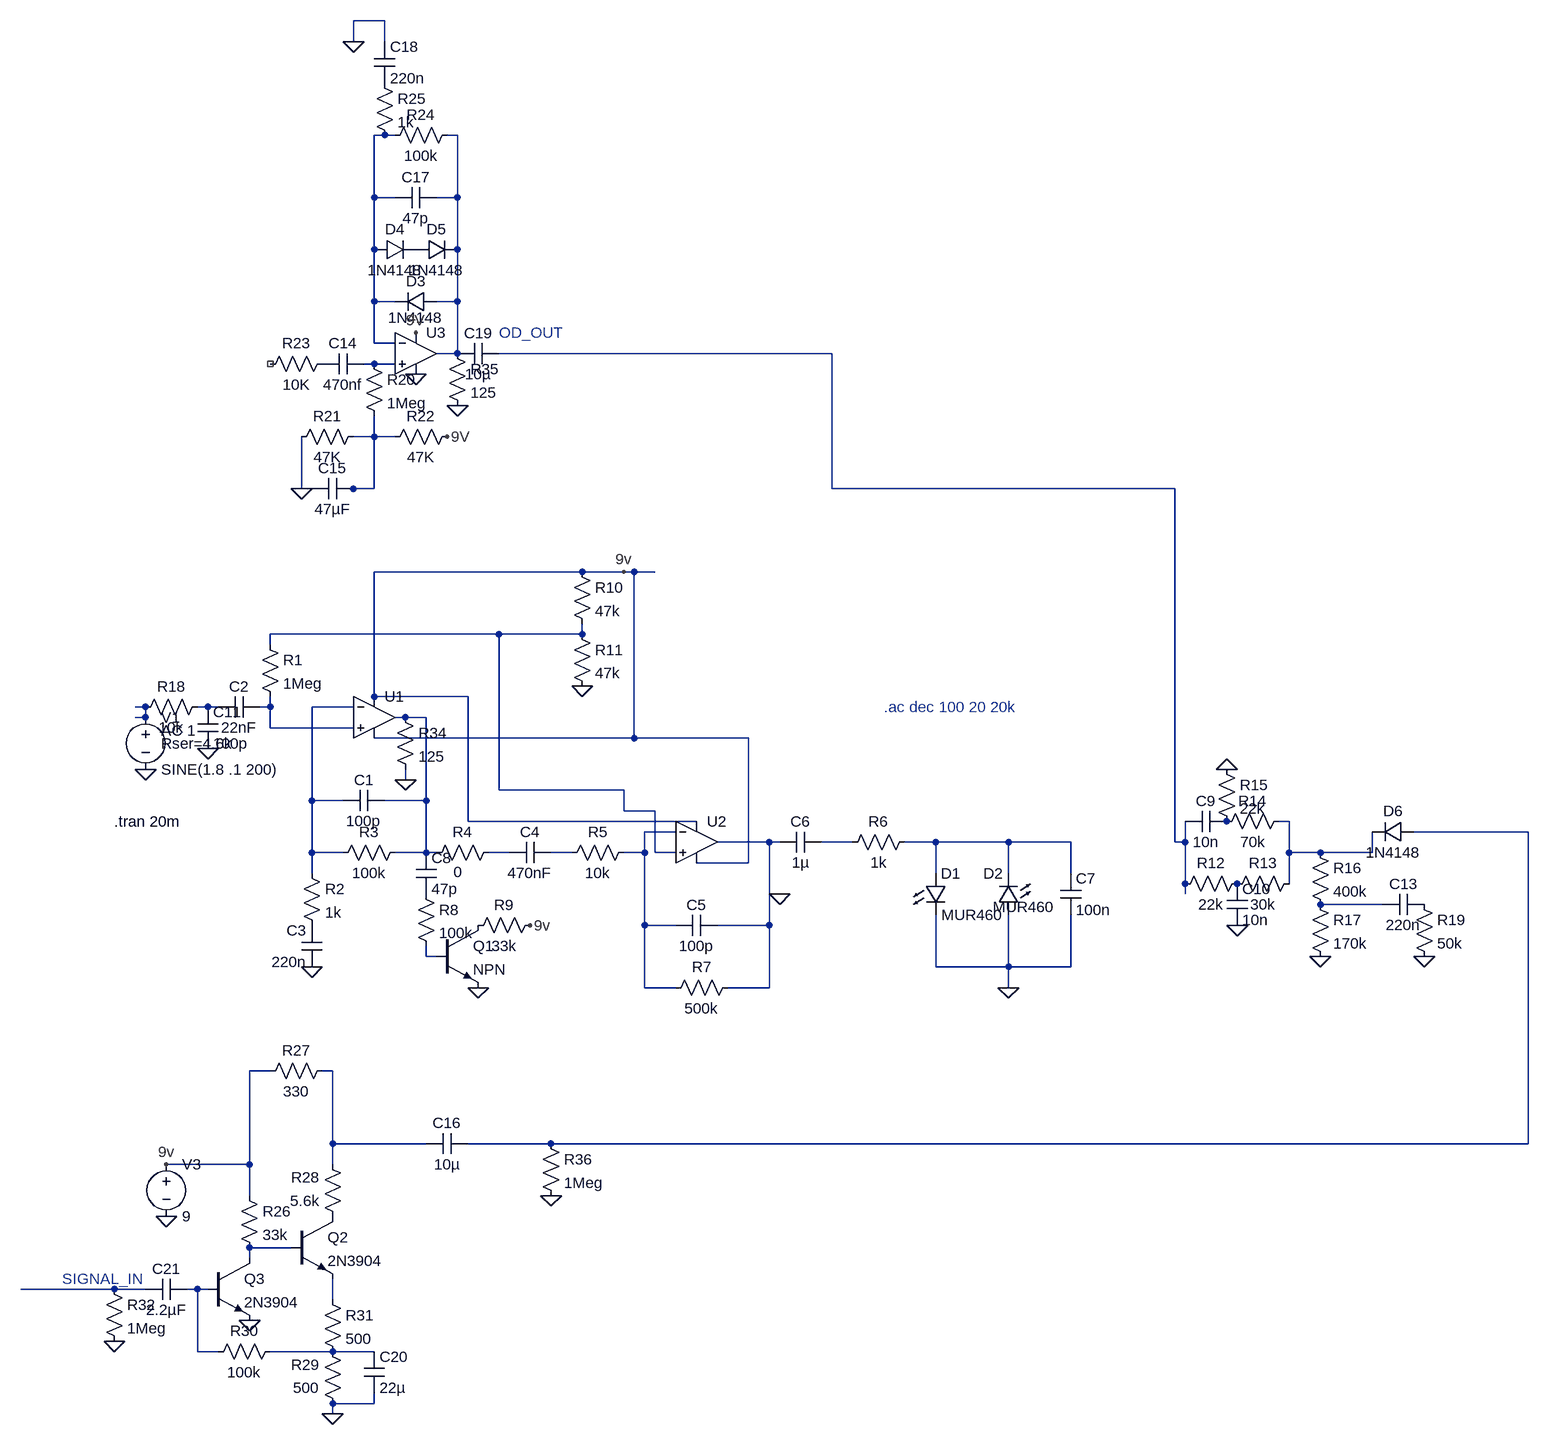
[diagram p0: schematic distortion.asc]
distortion.asc, the LTspice schematic file:
Version 4.1
SHEET 1 2036 912
WIRE 272 -1248 224 -1248
WIRE 224 -1216 224 -1248
WIRE 272 -1216 272 -1248
WIRE 272 -1072 256 -1072
WIRE 288 -1072 272 -1072
WIRE 384 -1072 368 -1072
WIRE 256 -976 256 -1072
WIRE 288 -976 256 -976
WIRE 384 -976 384 -1072
WIRE 384 -976 352 -976
WIRE 256 -896 256 -976
WIRE 384 -896 384 -976
WIRE 256 -816 256 -896
WIRE 288 -816 256 -816
WIRE 384 -816 384 -896
WIRE 384 -816 352 -816
WIRE 256 -752 256 -816
WIRE 288 -752 256 -752
WIRE 384 -736 384 -816
WIRE 384 -736 352 -736
WIRE 960 -736 448 -736
WIRE 256 -720 240 -720
WIRE 288 -720 256 -720
WIRE 256 -608 256 -640
WIRE 256 -608 224 -608
WIRE 288 -608 256 -608
WIRE 144 -528 144 -608
WIRE 160 -528 144 -528
WIRE 224 -528 208 -528
WIRE 256 -528 256 -608
WIRE 256 -528 224 -528
WIRE 960 -528 960 -736
WIRE 1488 -528 960 -528
WIRE 576 -400 256 -400
WIRE 640 -400 576 -400
WIRE 656 -400 640 -400
WIRE 688 -400 656 -400
WIRE 448 -304 96 -304
WIRE 576 -304 576 -320
WIRE 576 -304 448 -304
WIRE 96 -288 96 -304
WIRE 256 -208 256 -400
WIRE 400 -208 256 -208
WIRE -96 -192 -112 -192
WIRE 0 -192 -16 -192
WIRE 16 -192 0 -192
WIRE 96 -192 96 -208
WIRE 96 -192 80 -192
WIRE 224 -192 160 -192
WIRE -96 -176 -96 -192
WIRE -96 -176 -112 -176
WIRE 304 -176 288 -176
WIRE 336 -176 304 -176
WIRE 96 -160 96 -192
WIRE 224 -160 96 -160
WIRE 656 -144 656 -400
WIRE 656 -144 256 -144
WIRE 832 -144 656 -144
WIRE 304 -80 304 -96
WIRE 448 -64 448 -304
WIRE 640 -64 448 -64
WIRE 160 -48 160 -192
WIRE 208 -48 160 -48
WIRE 336 -48 336 -176
WIRE 336 -48 272 -48
WIRE 640 -32 640 -64
WIRE 688 -32 640 -32
WIRE 400 -16 400 -208
WIRE 752 -16 400 -16
WIRE 1664 -16 1648 -16
WIRE 720 0 672 0
WIRE 2032 0 1856 0
WIRE 864 16 784 16
WIRE 880 16 864 16
WIRE 992 16 944 16
WIRE 1120 16 1072 16
WIRE 1232 16 1120 16
WIRE 1328 16 1232 16
WIRE 1488 16 1488 -528
WIRE 1504 16 1504 -16
WIRE 1504 16 1488 16
WIRE 160 32 160 -48
WIRE 208 32 160 32
WIRE 336 32 336 -48
WIRE 336 32 288 32
WIRE 352 32 336 32
WIRE 464 32 432 32
WIRE 560 32 528 32
WIRE 672 32 672 0
WIRE 672 32 640 32
WIRE 688 32 688 -32
WIRE 720 32 688 32
WIRE 1664 32 1664 -16
WIRE 1712 32 1664 32
WIRE 1792 32 1792 0
WIRE 1792 32 1712 32
WIRE 832 48 832 -144
WIRE 832 48 752 48
WIRE 160 64 160 32
WIRE 1120 64 1120 16
WIRE 1232 64 1232 16
WIRE 1328 64 1328 16
WIRE 1504 80 1504 16
WIRE 1664 80 1664 32
WIRE 1504 96 1504 80
WIRE 1808 112 1712 112
WIRE 672 144 672 32
WIRE 720 144 672 144
WIRE 864 144 864 16
WIRE 864 144 784 144
WIRE 336 192 336 176
WIRE 352 192 336 192
WIRE 1120 208 1120 128
WIRE 1232 208 1232 128
WIRE 1232 208 1120 208
WIRE 1328 208 1328 128
WIRE 1328 208 1232 208
WIRE 672 240 672 144
WIRE 720 240 672 240
WIRE 864 240 864 144
WIRE 864 240 800 240
WIRE 1232 240 1232 208
WIRE 96 368 64 368
WIRE 192 368 176 368
WIRE 192 480 192 368
WIRE 336 480 192 480
WIRE 528 480 400 480
WIRE 2032 480 2032 0
WIRE 2032 480 528 480
WIRE 64 512 64 368
WIRE 64 512 -64 512
WIRE 192 512 192 480
WIRE 64 560 64 512
WIRE 128 640 64 640
WIRE 64 656 64 640
WIRE -144 704 -288 704
WIRE -96 704 -144 704
WIRE -16 704 -32 704
WIRE 0 704 -16 704
WIRE 192 720 192 688
WIRE -16 800 -16 704
WIRE 16 800 -16 800
WIRE 192 800 96 800
WIRE 256 800 192 800
WIRE 256 880 256 864
WIRE 256 880 192 880
WIRE 192 896 192 880
FLAG 160 208 0
FLAG 1232 240 0
FLAG -96 -96 0
FLAG 576 -224 0
FLAG 416 240 0
FLAG 640 -400 9v
FLAG 496 144 9v
FLAG 1584 144 0
FLAG 1568 -96 0
FLAG 1712 192 0
FLAG 0 -128 0
FLAG 1872 192 0
FLAG 144 -528 0
FLAG 224 -1216 0
FLAG 368 -608 9V
FLAG 320 -768 9V
FLAG 320 -704 0
FLAG -64 592 0
FLAG 192 896 0
FLAG 64 752 0
FLAG -64 512 9v
FLAG -144 784 0
FLAG 880 96 0
FLAG 304 -80 0
FLAG 384 -656 0
FLAG 528 560 0
SYMBOL cap 272 -64 R90
WINDOW 0 0 32 VBottom 2
WINDOW 3 32 32 VTop 2
SYMATTR InstName C1
SYMATTR Value 100p
SYMBOL res 80 -304 R0
SYMATTR InstName R1
SYMATTR Value 1Meg
SYMBOL res 144 48 R0
SYMATTR InstName R2
SYMATTR Value 1k
SYMBOL cap 176 208 R180
WINDOW 0 24 56 Left 2
WINDOW 3 24 8 Left 2
SYMATTR InstName C3
SYMATTR Value 220n
SYMBOL res 304 16 R90
WINDOW 0 0 56 VBottom 2
WINDOW 3 32 56 VTop 2
SYMATTR InstName R3
SYMATTR Value 100k
SYMBOL res 448 16 R90
WINDOW 0 0 56 VBottom 2
WINDOW 3 30 63 VTop 2
SYMATTR InstName R4
SYMATTR Value 0
SYMBOL cap 528 16 R90
WINDOW 0 0 32 VBottom 2
WINDOW 3 32 32 VTop 2
SYMATTR InstName C4
SYMATTR Value 470nF
SYMBOL res 656 16 R90
WINDOW 0 0 56 VBottom 2
WINDOW 3 32 56 VTop 2
SYMATTR InstName R5
SYMATTR Value 10k
SYMBOL cap 784 128 R90
WINDOW 0 0 32 VBottom 2
WINDOW 3 32 32 VTop 2
SYMATTR InstName C5
SYMATTR Value 100p
SYMBOL cap 944 0 R90
WINDOW 0 0 32 VBottom 2
WINDOW 3 32 32 VTop 2
SYMATTR InstName C6
SYMATTR Value 1µ
SYMBOL res 976 32 R270
WINDOW 0 32 56 VTop 2
WINDOW 3 0 56 VBottom 2
SYMATTR InstName R6
SYMATTR Value 1k
SYMBOL LED 1104 64 R0
WINDOW 3 104 52 Left 2
SYMATTR Value MUR460
SYMATTR InstName D1
SYMBOL cap 1312 64 R0
SYMATTR InstName C7
SYMATTR Value 100n
SYMBOL res 816 224 R90
WINDOW 0 0 56 VBottom 2
WINDOW 3 32 56 VTop 2
SYMATTR InstName R7
SYMATTR Value 500k
SYMBOL cap 80 -208 R90
WINDOW 0 0 32 VBottom 2
WINDOW 3 32 32 VTop 2
SYMATTR InstName C2
SYMATTR Value 22nF
SYMBOL voltage -96 -192 R0
WINDOW 123 24 36 Left 2
WINDOW 39 24 56 Left 2
SYMATTR Value2 AC 1
SYMATTR SpiceLine Rser=4.6k
SYMATTR InstName V1
SYMATTR Value SINE(1.8 .1 200)
SYMBOL res 560 -416 R0
SYMATTR InstName R10
SYMATTR Value 47k
SYMBOL res 560 -320 R0
SYMATTR InstName R11
SYMATTR Value 47k
SYMBOL OpAmps\\UniversalOpAmp1 256 -176 R0
SYMATTR InstName U1
SYMBOL OpAmps\\UniversalOpAmp1 752 16 R0
SYMATTR InstName U2
SYMBOL cap 320 32 R0
SYMATTR InstName C8
SYMATTR Value 47p
SYMBOL res 320 80 R0
SYMATTR InstName R8
SYMATTR Value 100k
SYMBOL npn 352 144 R0
SYMATTR InstName Q1
SYMBOL res 512 128 R90
WINDOW 0 0 56 VBottom 2
WINDOW 3 32 56 VTop 2
SYMATTR InstName R9
SYMATTR Value 33k
SYMBOL cap 1568 -32 R90
WINDOW 0 0 32 VBottom 2
WINDOW 3 32 32 VTop 2
SYMATTR InstName C9
SYMATTR Value 10n
SYMBOL res 1600 64 R90
WINDOW 0 0 56 VBottom 2
WINDOW 3 32 56 VTop 2
SYMATTR InstName R12
SYMATTR Value 22k
SYMBOL cap 1568 80 R0
SYMATTR InstName C10
SYMATTR Value 10n
SYMBOL res 1680 64 R90
WINDOW 0 0 56 VBottom 2
WINDOW 3 32 56 VTop 2
SYMATTR InstName R13
SYMATTR Value 30k
SYMBOL res 1664 -32 R90
WINDOW 0 0 56 VBottom 2
WINDOW 3 32 56 VTop 2
SYMATTR InstName R14
SYMATTR Value 70k
SYMBOL res 1552 -112 R0
SYMATTR InstName R15
SYMATTR Value 22k
SYMBOL res 1696 16 R0
SYMATTR InstName R16
SYMATTR Value 400k
SYMBOL res 1696 96 R0
SYMATTR InstName R17
SYMATTR Value 170k
SYMBOL res 0 -208 R90
WINDOW 0 0 56 VBottom 2
WINDOW 3 32 56 VTop 2
SYMATTR InstName R18
SYMATTR Value 10k
SYMBOL cap -16 -192 R0
SYMATTR InstName C11
SYMATTR Value 100p
SYMBOL LED 1248 128 R180
WINDOW 3 24 0 Left 2
WINDOW 0 24 64 Left 2
SYMATTR Value MUR460
SYMATTR InstName D2
SYMBOL cap 1872 96 R90
WINDOW 0 0 32 VBottom 2
WINDOW 3 32 32 VTop 2
SYMATTR InstName C13
SYMATTR Value 220n
SYMBOL res 1856 96 R0
SYMATTR InstName R19
SYMATTR Value 50k
SYMBOL OpAmps\\UniversalOpAmp1 320 -736 R0
SYMATTR InstName U3
SYMBOL cap 240 -736 R90
WINDOW 0 0 32 VBottom 2
WINDOW 3 32 32 VTop 2
SYMATTR InstName C14
SYMATTR Value 470nf
SYMBOL res 240 -736 R0
SYMATTR InstName R20
SYMATTR Value 1Meg
SYMBOL res 240 -624 R90
WINDOW 0 0 56 VBottom 2
WINDOW 3 32 56 VTop 2
SYMATTR InstName R21
SYMATTR Value 47K
SYMBOL res 384 -624 R90
WINDOW 0 0 56 VBottom 2
WINDOW 3 32 56 VTop 2
SYMATTR InstName R22
SYMATTR Value 47K
SYMBOL cap 224 -544 R90
WINDOW 0 0 32 VBottom 2
WINDOW 3 32 32 VTop 2
SYMATTR InstName C15
SYMATTR Value 47µF
SYMBOL res 192 -736 R90
WINDOW 0 0 56 VBottom 2
WINDOW 3 32 56 VTop 2
SYMATTR InstName R23
SYMATTR Value 10K
SYMBOL diode 352 -832 R90
WINDOW 0 0 32 VBottom 2
WINDOW 3 25 32 VTop 2
SYMATTR InstName D3
SYMATTR Value 1N4148
SYMBOL cap 352 -992 R90
WINDOW 0 0 32 VBottom 2
WINDOW 3 32 32 VTop 2
SYMATTR InstName C17
SYMATTR Value 47p
SYMBOL res 384 -1088 R90
WINDOW 0 0 56 VBottom 2
WINDOW 3 32 56 VTop 2
SYMATTR InstName R24
SYMATTR Value 100k
SYMBOL res 256 -1168 R0
SYMATTR InstName R25
SYMATTR Value 1k
SYMBOL cap 256 -1216 R0
SYMATTR InstName C18
SYMATTR Value 220n
SYMBOL cap 448 -752 R90
WINDOW 0 0 32 VBottom 2
WINDOW 3 32 32 VTop 2
SYMATTR InstName C19
SYMATTR Value 10µ
SYMBOL diode 256 -880 R270
WINDOW 0 32 32 VTop 2
WINDOW 3 0 32 VBottom 2
SYMATTR InstName D4
SYMATTR Value 1N4148
SYMBOL diode 320 -880 R270
WINDOW 0 32 32 VTop 2
WINDOW 3 0 32 VBottom 2
SYMATTR InstName D5
SYMATTR Value 1N4148
SYMBOL voltage -64 496 R0
SYMATTR InstName V3
SYMATTR Value 9
SYMBOL res 48 544 R0
SYMATTR InstName R26
SYMATTR Value 33k
SYMBOL res 192 352 R90
WINDOW 0 0 56 VBottom 2
WINDOW 3 32 56 VTop 2
SYMATTR InstName R27
SYMATTR Value 330
SYMBOL res 208 608 R180
WINDOW 0 36 76 Left 2
WINDOW 3 36 40 Left 2
SYMATTR InstName R28
SYMATTR Value 5.6k
SYMBOL res 208 896 R180
WINDOW 0 36 76 Left 2
WINDOW 3 36 40 Left 2
SYMATTR InstName R29
SYMATTR Value 500
SYMBOL cap 240 800 R0
SYMATTR InstName C20
SYMATTR Value 22µ
SYMBOL npn 128 592 R0
SYMATTR InstName Q2
SYMATTR Value 2N3904
SYMBOL res 112 784 R90
WINDOW 0 0 56 VBottom 2
WINDOW 3 32 56 VTop 2
SYMATTR InstName R30
SYMATTR Value 100k
SYMBOL res 176 704 R0
SYMATTR InstName R31
SYMATTR Value 500
SYMBOL npn 0 656 R0
SYMATTR InstName Q3
SYMATTR Value 2N3904
SYMBOL cap -32 688 R90
WINDOW 0 0 32 VBottom 2
WINDOW 3 32 32 VTop 2
SYMATTR InstName C21
SYMATTR Value 2.2µF
SYMBOL res -160 688 R0
SYMATTR InstName R32
SYMATTR Value 1Meg
SYMBOL res 288 -192 R0
SYMATTR InstName R34
SYMATTR Value 125
SYMBOL res 368 -752 R0
SYMATTR InstName R35
SYMATTR Value 125
SYMBOL cap 400 464 R90
WINDOW 0 0 32 VBottom 2
WINDOW 3 32 32 VTop 2
SYMATTR InstName C16
SYMATTR Value 10µ
SYMBOL diode 1856 -16 R90
WINDOW 0 0 32 VBottom 2
WINDOW 3 32 32 VTop 2
SYMATTR InstName D6
SYMATTR Value 1N4148
SYMBOL res 512 464 R0
SYMATTR InstName R36
SYMATTR Value 1Meg
TEXT -144 -16 Left 2 !.tran 20m
TEXT 1040 -192 Left 2 ;.ac dec 100 20 20k
TEXT -224 688 Left 2 ;SIGNAL_IN
TEXT 448 -768 Left 2 ;OD_OUT

The netlist it stands for:
* distortion.asc
C1 N011 N010 100p
R1 N006 N009 1Meg
R2 N010 P001 1k
C3 0 P001 220n
R3 N011 N010 100k
R4 N018 N011 0
C4 N019 N018 470nF
R5 N013 N019 10k
C5 N015 N013 100p
C6 N016 N015 1µ
R6 N016 N017 1k
D1 N017 0 MUR460
C7 N017 0 100n
R7 N015 N013 500k
C2 N009 N008 22nF
V1 N007 0 SINE(1.8 .1 200) AC 1 Rser=4.6k
R10 9v N006 47k
R11 N006 0 47k
X§U1 N009 N010 9v 9v N011 level1 Avol=1Meg GBW=10Meg Vos=0 En=0 Enk=0 In=0 Ink=0 Rin=500Meg  ; pins In+ In- V+ V- OUT
X§U2 N006 N013 9v 9v N015 level1 Avol=1Meg GBW=10Meg Vos=0 En=0 Enk=0 In=0 Ink=0 Rin=500Meg  ; pins In+ In- V+ V- OUT
C8 N011 P002 47p
R8 P002 N021 100k
Q1 P003 N021 0 0 NPN
R9 9v P003 33k
C9 P004 N003 10n
R12 P005 N003 22k
C10 P005 0 10n
R13 N012 P005 30k
R14 N012 P004 70k
R15 0 P004 22k
R16 N012 N020 400k
R17 N020 0 170k
R18 N008 N007 10k
C11 N008 0 100p
D2 0 N017 MUR460
C13 P006 N020 220n
R19 P006 0 50k
X§U3 N004 N001 9v 0 N002 level1 Avol=1Meg GBW=10Meg Vos=0 En=0 Enk=0 In=0 Ink=0 Rin=500Meg  ; pins In+ In- V+ V- OUT
C14 N004 P007 470nf
R20 N004 N005 1Meg
R21 N005 0 47K
R22 9v N005 47K
C15 N005 0 47µF
R23 P007 NC_01 10K
D3 N002 N001 1N4148
C17 N002 N001 47p
R24 N002 N001 100k
R25 P008 N001 1k
C18 0 P008 220n
C19 N003 N002 10µ
D4 N001 P009 1N4148
D5 P009 N002 1N4148
V3 9v 0 9
R26 9v N023 33k
R27 N022 9v 330
R28 P010 N022 5.6k
R29 0 N027 500
C20 N027 0 22µ
Q2 P010 N023 N026 0 2N3904
R30 N027 N025 100k
R31 N026 N027 500
Q3 N023 N025 0 0 2N3904
C21 N025 N024 2.2µF
R32 N024 0 1Meg
R34 N011 0 125
R35 N002 0 125
C16 N014 N022 10µ
D6 N014 N012 1N4148
R36 N014 0 1Meg
.model D D
.lib standard.dio
.model NPN NPN
.model PNP PNP
.lib standard.bjt
.tran 20m
* .ac dec 100 20 20k
* SIGNAL_IN
* OD_OUT
.lib UniversalOpAmp1.lib
.backanno
.end